# EAGLE design halloween-grave-bell-v02 (EAGLE 7.7.0)
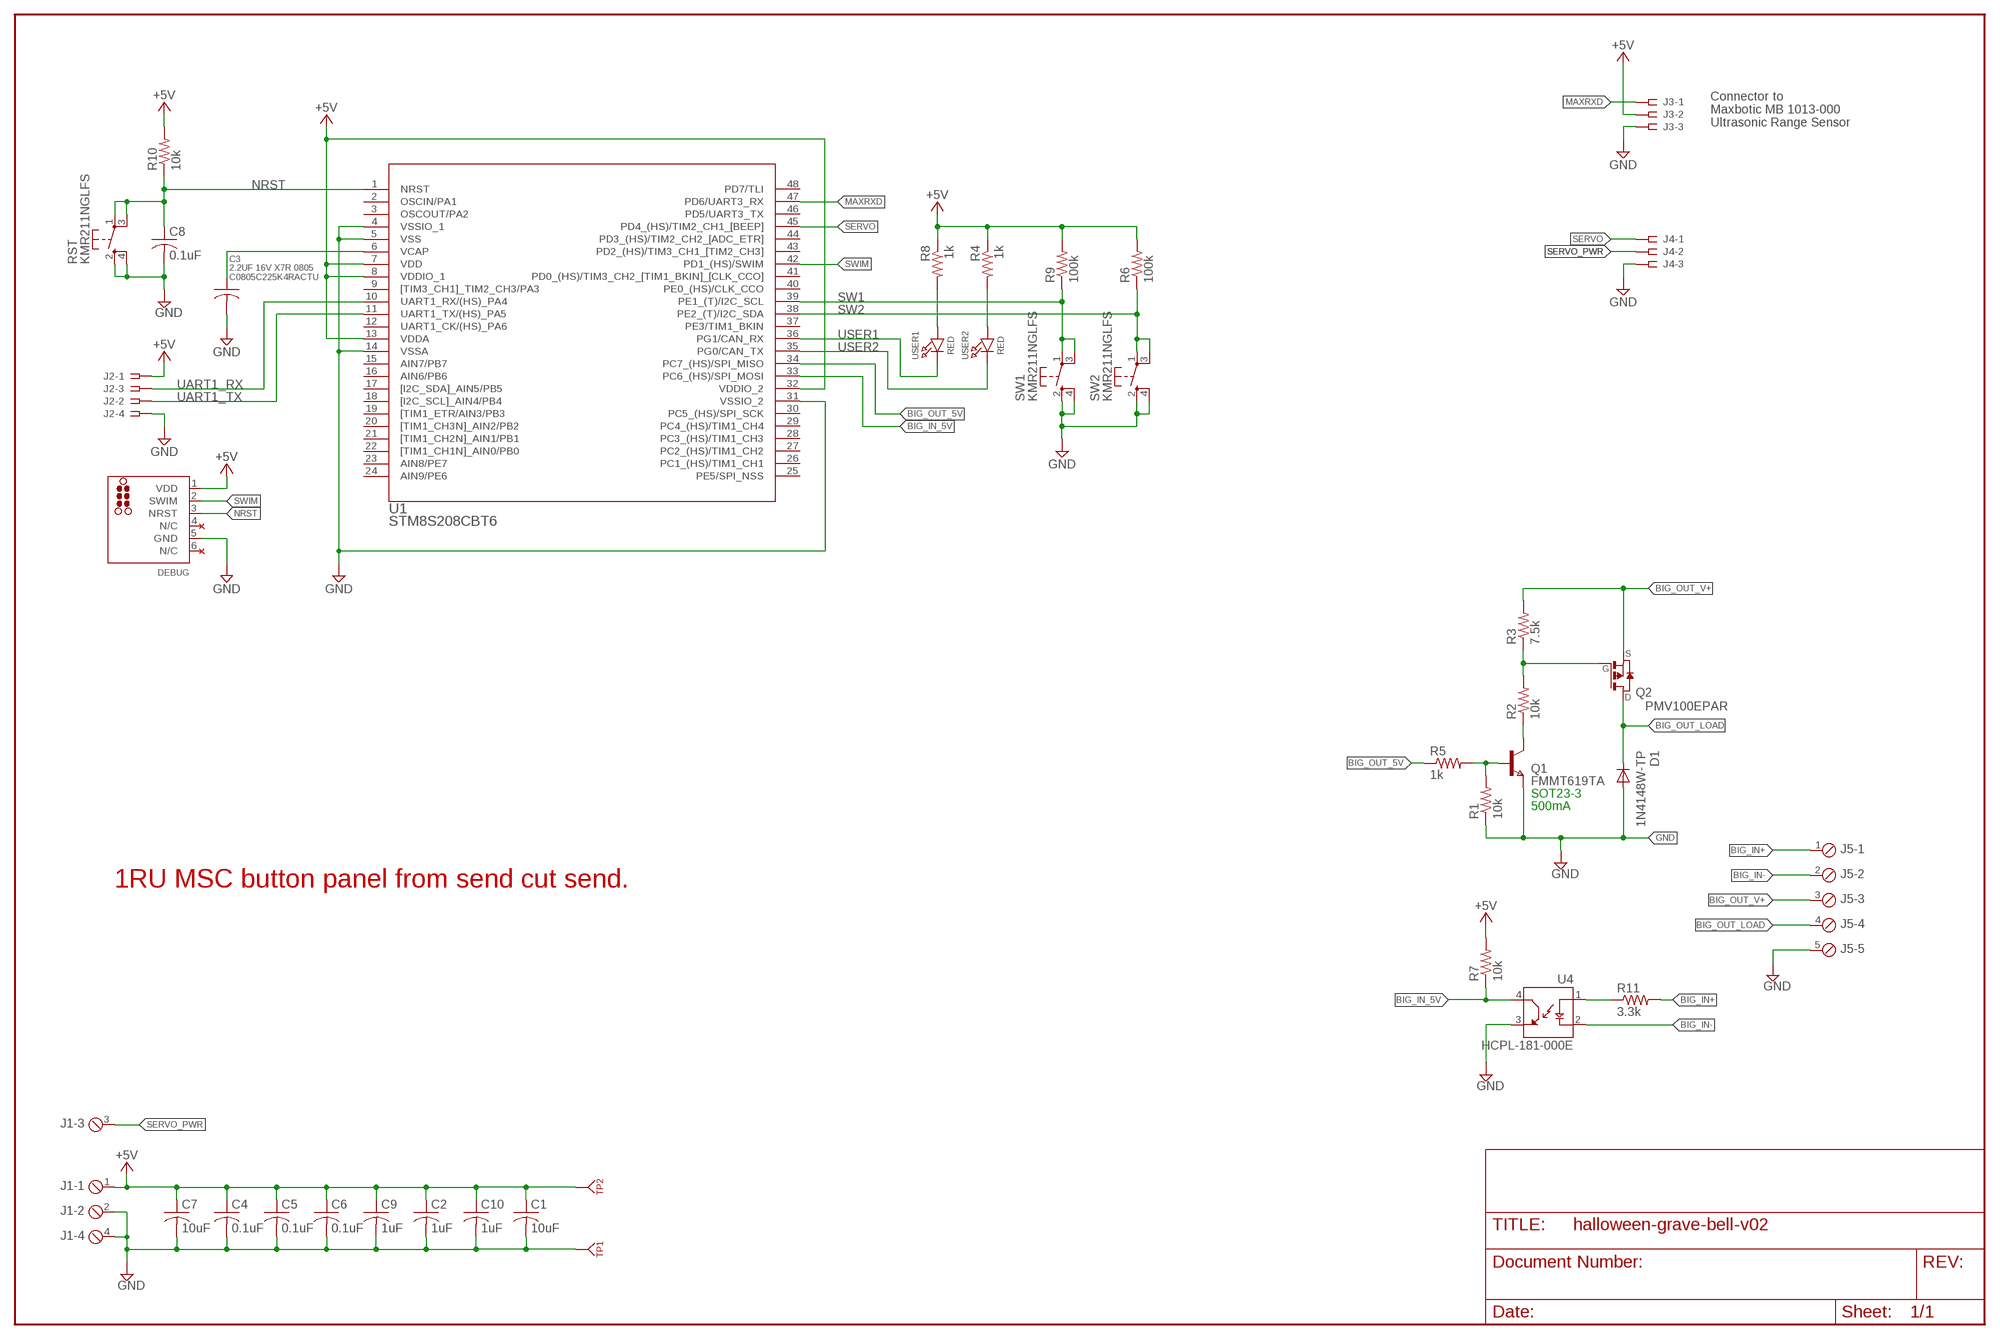
[diagram p0: schematic, sheet 1]

## Parts
C1  10uF  C-USC1210  [C1210]
C2  1uF  C-USC0603  [C0603]
C3  2.2UF 16V X7R 0805  C-USC0805  [C0805]
C4  0.1uF  C-USC0603  [C0603]
C5  0.1uF  C-USC0603  [C0603]
C6  0.1uF  C-USC0603  [C0603]
C7  10uF  C-USC1210  [C1210]
C8  0.1uF  C-USC0805  [C0805]
C9  1uF  C-USC0603  [C0603]
C10  1uF  C-USC0603  [C0603]
D1  1N4148W-TP  DIODE-SOD123  [SOD123]
DEBUG  TC2030-NL-STM8  [TC2030-NL]
J1  MPT4  [4POL254]
J2  SSW-104-02-S-S  [SSW-104-02-S-S]
J3  SSW-103-02-S-S  [SSW-103-02-S-S]
J4  SSW-103-02-S-S  [SSW-103-02-S-S]
J5  MPT5  [5POL254]
Q1  FMMT619TA  NPNSOT23  [SOT-23]
Q2  PMOSSOT23  [SOT-23]
R1  10k  R-US_R0603  [R0603]
R2  10k  R-US_R0603  [R0603]
R3  7.5k  R-US_R0603  [R0603]
R4  1k  R-US_R0805  [R0805]
R5  1k  R-US_R0603  [R0603]
R6  100k  R-US_R0805  [R0805]
R7  10k  R-US_R0603  [R0603]
R8  1k  R-US_R0805  [R0805]
R9  100k  R-US_R0805  [R0805]
R10  10k  R-US_R0805  [R0805]
R11  3.3k  R-US_R0603  [R0603]
RST  KMR211NGLFS  SPST_TACT-KMR2  [KMR2]
SW1  KMR211NGLFS  SPST_TACT-KMR2  [KMR2]
SW2  KMR211NGLFS  SPST_TACT-KMR2  [KMR2]
TP1  KEYSTONE_500X  [KEYSTONE_TP500X]
TP2  KEYSTONE_500X  [KEYSTONE_TP500X]
U1  STM8S208CBT6  [LQFP-48_STM]
U4  HCPL-181-000E  [SOIC254P675X240-4N]
USER1  RED  LED0805_NOOUTLINE  [CHIPLED_0805_NOOUTLINE]
USER2  RED  LED0805_NOOUTLINE  [CHIPLED_0805_NOOUTLINE]

## Nets
+5V: C1.1 C2.1 C4.1 C5.1 C6.1 C7.1 C9.1 C10.1 DEBUG.1(VDD) J1.1 J2.1 J3.2 R4.1 R6.2 R7.2 R8.1 R9.2 R10.2 TP2.1 U1.7(VDD) U1.8(VDDIO_1) U1.13(VDDA) U1.32(VDDIO_2)
BIG_IN+: J5.1 R11.2
BIG_IN-: J5.2 U4.2(CATHODE)
BIG_IN_5V: R7.1 U1.33(PC6_(HS)/SPI_MOSI) U4.4(COLLECTOR)
BIG_OUT_5V: R5.1 U1.34(PC7_(HS)/SPI_MISO)
BIG_OUT_LOAD: D1.C J5.4 Q2.1(D)
BIG_OUT_V+: J5.3 Q2.2(S) R3.2
GND: C1.2 C2.2 C3.2 C4.2 C5.2 C6.2 C7.2 C8.2 C9.2 C10.2 D1.A DEBUG.5(GND) J1.2 J1.4 J2.4 J3.3 J4.3 J5.5 Q1.2(E) R1.1 RST.2(S) RST.4(S1) SW1.2(S) SW1.4(S1) SW2.2(S) SW2.4(S1) TP1.1 U1.4(VSSIO_1) U1.5(VSS) U1.14(VSSA) U1.31(VSSIO_2) U4.3(EMITTER)
MAXRXD: J3.1 U1.47(PD6/UART3_RX)
N$1: Q1.1(C) R2.1
N$2: R8.2 USER1.A
N$4: Q2.3(G) R2.2 R3.1
N$5: R4.2 USER2.A
N$15: R11.1 U4.1(ANODE)
N$16: Q1.3(B) R1.2 R5.2
NRST: C8.1 DEBUG.3(NRST) R10.1 RST.1(P) RST.3(P1) U1.1(NRST)
SERVO: J4.1 U1.45(PD4_(HS)/TIM2_CH1_[BEEP])
SERVO_PWR: J1.3 J4.2
SW1: R9.1 SW1.1(P) SW1.3(P1) U1.39(PE1_(T)/I2C_SCL)
SW2: R6.1 SW2.1(P) SW2.3(P1) U1.38(PE2_(T)/I2C_SDA)
SWIM: DEBUG.2(SWIM) U1.42(PD1_(HS)/SWIM)
UART1_RX: J2.3 U1.10(UART1_RX/(HS)_PA4)
UART1_TX: J2.2 U1.11(UART1_TX/(HS)_PA5)
USER1: U1.36(PG1/CAN_RX) USER1.C
USER2: U1.35(PG0/CAN_TX) USER2.C
VCAP: C3.1 U1.6(VCAP)
Unconnected: DEBUG.4(N/C) DEBUG.6(N/C) U1.2(OSCIN/PA1) U1.3(OSCOUT/PA2) U1.9([TIM3_CH1]_TIM2_CH3/PA3) U1.12(UART1_CK/(HS)_PA6) U1.15(AIN7/PB7) U1.16(AIN6/PB6) U1.17([I2C_SDA]_AIN5/PB5) U1.18([I2C_SCL]_AIN4/PB4) U1.19([TIM1_ETR/AIN3/PB3) U1.20([TIM1_CH3N]_AIN2/PB2) U1.21([TIM1_CH2N]_AIN1/PB1) U1.22([TIM1_CH1N]_AIN0/PB0) U1.23(AIN8/PE7) U1.24(AIN9/PE6) U1.25(PE5/SPI_NSS) U1.26(PC1_(HS)/TIM1_CH1) U1.27(PC2_(HS)/TIM1_CH2) U1.28(PC3_(HS)/TIM1_CH3) U1.29(PC4_(HS)/TIM1_CH4) U1.30(PC5_(HS)/SPI_SCK) U1.37(PE3/TIM1_BKIN) U1.40(PE0_(HS)/CLK_CCO) U1.41(PD0_(HS)/TIM3_CH2_[TIM1_BKIN]_[CLK_CCO]) U1.43(PD2_(HS)/TIM3_CH1_[TIM2_CH3]) U1.44(PD3_(HS)/TIM2_CH2_[ADC_ETR]) U1.46(PD5/UART3_TX) U1.48(PD7/TLI)

## Notes on the sheet
- Connector to
  Maxbotic MB 1013-000
  Ultrasonic Range Sensor
- S
- G
- D
- ‎PMV100EPAR‎
- SOT23-3
- 500mA
- 1RU MSC button panel from send cut send.

## Library data of the parts
C1 C7 = rcl:C-US: CAPACITOR, American symbol; MFR: KEMET; MFR_PART_NO: C1210C105K4PACTU
C2 C4-C6 C8-C10 = rcl:C-US: CAPACITOR, American symbol
C3 = resistor:C-US: CAPACITOR, American symbol; MFR_PART_NUM: C0805C225K4RACTU
D1 = diode:DIODE-: DIODE
DEBUG = 0GLEN-TC2030-NL-STM8:TC2030-NL-STM8
J1 = con-phoenix-254:MPT4: PHOENIX CONNECTOR; OC_FARNELL: unknown; OC_NEWARK: unknown
J2 = con-samtec:SSW-104-02-S-S: THROUGH-HOLE .025" SQ POST SOCKET Source: Samtec SSW.pdf; MPN: SSW-104-02-S-S; OC_FARNELL: unknown; OC_NEWARK: 11P9384
J3 J4 = con-samtec:SSW-103-02-S-S: THROUGH-HOLE .025" SQ POST SOCKET Source: Samtec SSW.pdf; MPN: SSW-103-02-S-S; OC_FARNELL: unknown; OC_NEWARK: 11P9367
J5 = con-phoenix-254:MPT5: PHOENIX CONNECTOR; OC_FARNELL: unknown; OC_NEWARK: unknown
Q1 = zetex:NPNSOT23: NPN TRANSISTOR; MPN: DSS20201L-7; OC_FARNELL: 1710688; OC_NEWARK: 25R4555
Q2 = zetex:PMOSSOT23: MOS FET; OC_FARNELL: unknown; OC_NEWARK: unknown
R1-R11 = rcl:R-US_: RESISTOR, American symbol
RST SW1 SW2 = adafruit:SPST_TACT: SMT 6mm switch, EVQQ2 series http://www.ladyada.net/library/eagle
TP1 TP2 = 0GlenConnectors:KEYSTONE_500X
U1 = STM8S208CBT6-glen-lib:STM8S208CBT6; BUILT_BY: EMA_UL_Team; MANUFACTURER_PART_NUMBER: STM8S208CBT6; SOURCELIBRARY: StMicro_2011-06-07; VENDOR: STMicroelectronics
U4 = HCPL-181-000E:HCPL-181-000E: Optocoupler; SMD; Channels: 1; Out: transistor; Uinsul: 3.75kV; SO4; DESCRIPTION: Optocoupler; SMD; Channels: 1; Out: transistor; Uinsul: 3.75kV; SO4; DIGI-KEY_PART_NUMBER: 516-1646-1-ND; DIGI-KEY_PURCHASE_URL: https://www.digikey.com/product-detail/en/broadcom-limited/HCPL-181-000E/516-1646-1-ND/825340?utm_source=snapeda&utm_medium=aggregator&utm_campaign=symbol; MF: Broadcom Limited; MP: HCPL-181-000E; PACKAGE: SO-4 Broadcom
USER1 USER2 = microbuilder:LED: LED 0603 - 0603 Surface Mount Package 2mA: Green LED - Low Power (3.9mcd, 2ma, 1.7Vf) - Digikey: 475-2709-2-ND Orange LED - Low Power (9.8mcd, 2ma, 1.8Vf) - Digikey: 475-1194-2-ND Red LED - Low Power (5mcd, 2ma, 1.8Vf) - Digikey: 475-1195-2-ND Yellow LED - Low Power (7mcd, 2ma, 1.8Vf) - Digikey: 475-1196-2-ND 5mA: Blue LED - Low Power (17mcd, 5ma, 2.9Vf) - Digikey: LNJ937W8CRACT-ND 0805 - 0805 Surface Mount Package 2mA: Red LED (8.8mcd, 2mA, 1.8Vf, Clear) - Low Power [Digikey: 475-2510-1-ND] Green LED (5mcd, 2mA, 1.8Vf, Clear) - Low Power [Digikey: 475-2730-1-ND] Yellow LED (11.3mcd, 2mA, 1.8Vf, Clear) - Low Power [Digikey: 475-2555-1-ND] 20mA: Red LED (104mcd, 20mA, Diffused) - LS R976 [Digikey: 475-1278-6-ND] Red LED (12mcd, 20mA, 2.0Vf, Clear) - APT2012EC [Digikey: 754-1128-1-ND] Green LED (15mcd, 20mA, 2.2Vf, Clear) - APT2012GC [Digikey: 754-1131-1-ND] Orange LED (160mcd, 20mA, 2.1Vf, Clear) - APT2012SECK [Digikey: 754-1130-1-ND] 1206 - 1206 Surface Mount Package Green LED (26mcd, 20mA, Diffused) - LG N971 [Digikey: 475-1407-6-ND] Red LED (15mcd, 20mA, Diffused) - LH N974 [Digikey: 475-1416-6-ND] Cree - Cree High-Power Surface Mount LEDs XPEBWT-L1-0000-00D50 - White 111lm 350mA 2.9Vf 6200K 110° XTEAWT-00-0000-00000LEE3 - White 114lm 350mA 2.85Vf 5000K 115° Everlight - Everlight 45-21 Series Surface Mount LEDs 45-21/QK2C-B2832AC2CB2/2T - Warm White 2000mcd 20mA 3.25Vf 3050K 120° 45-21/LK2C-B38452C4CB2/2T - Nuetral White 2000mcd 20mA 3.25Vf 4150K 120° 45-21/LK2C-B50634C6CB2/2T - Cold White 2200mcd 20mA 3.25Vf 5650K 120° PLCC2 Reverse Mount LS T77K-J1L2-1-0-2-R18-Z - Red 11.25mcd 2mA 1.8Vf 630nm 120° LO T77K-L1M2-24-Z - Orange 19.6mcd 2mA 1.8Vf 606nm 120° LY T77K-K2M1-26-Z - Yellow 15.7mcd 2mA 1.8Vf 587nm 120°

## Board
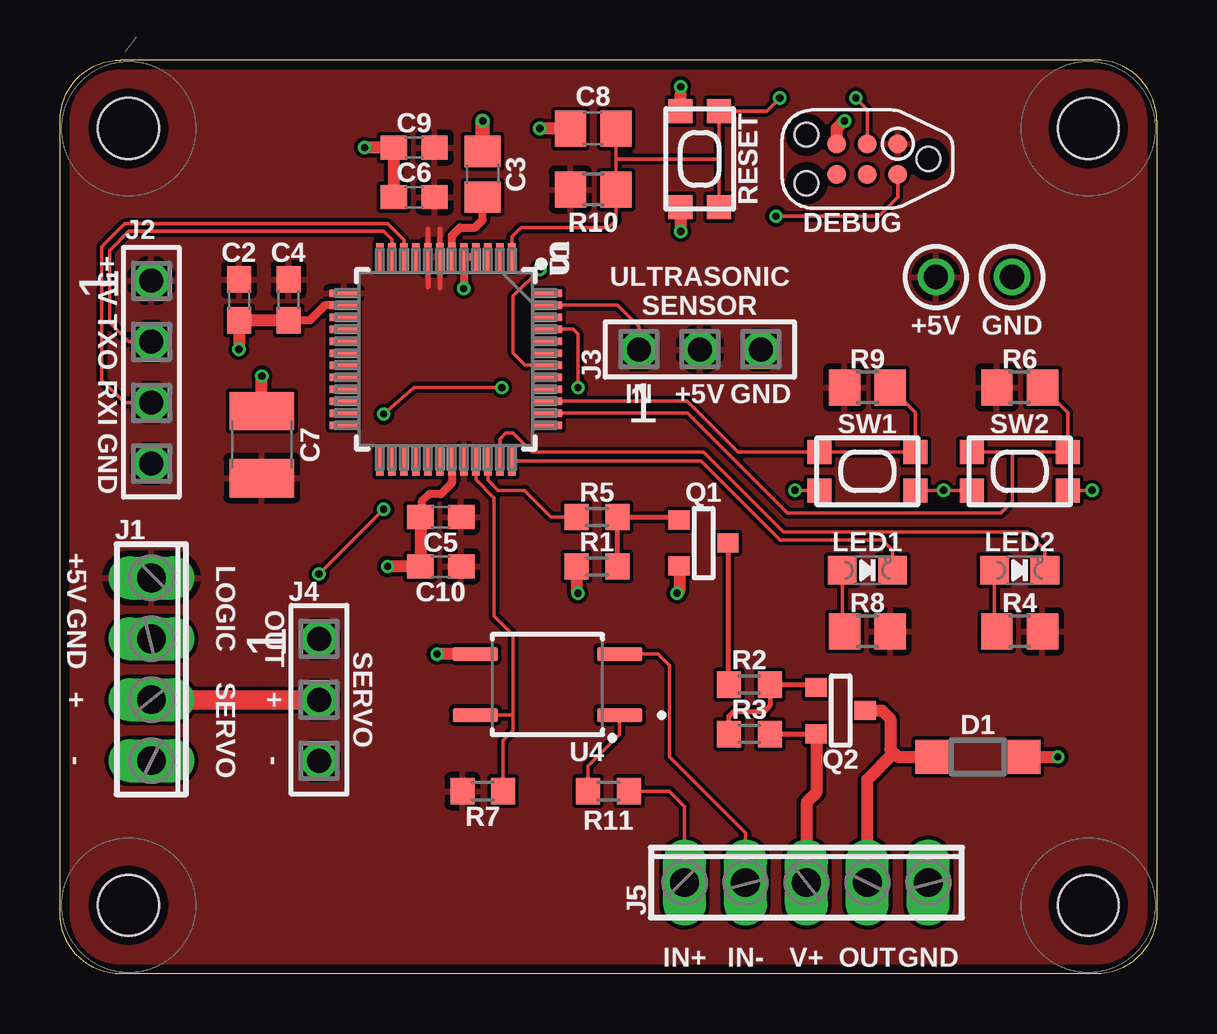
[diagram p1: board, top side]
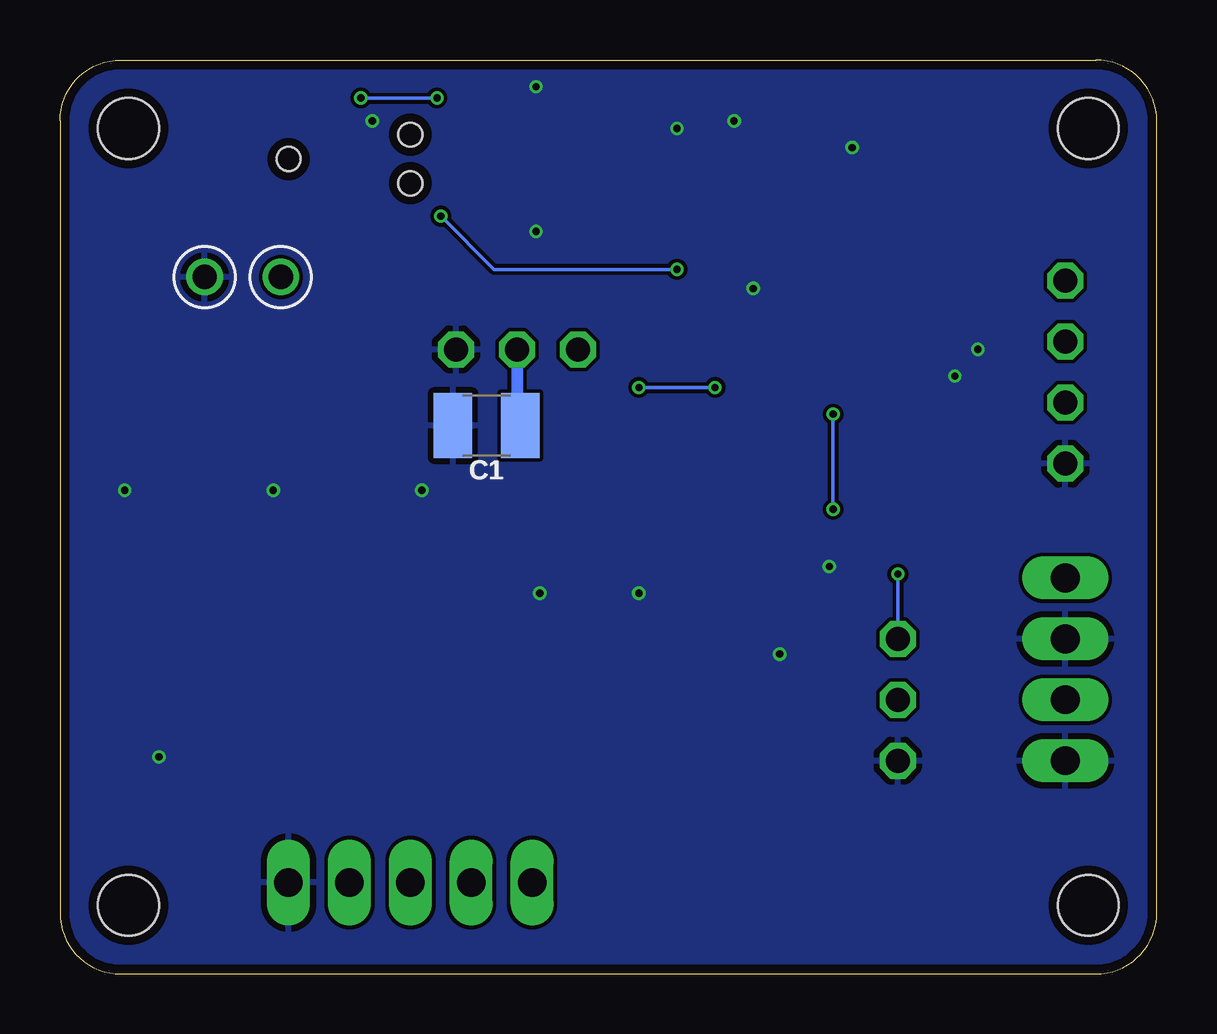
[diagram p2: board, bottom side, seen from below]

Size 45.72 x 38.1 mm. Coordinates in mm from the lower left corner, seen from the top.
Outline: 43.18,0 2.54,0 arc-90 0,2.54 0,35.56 arc-90 2.54,38.1 43.18,38.1 arc-90 45.72,35.56 45.72,2.54 arc-90 43.18,0
Copper layers (1*16): Top 0.035559375mm / dielectric 1.6mm / Bottom 0.035559375mm
Design rules "oshpark-2layer-2018": minimum track width 6mil, minimum drill 10mil, track to track 6mil, track to pad 6mil, pad to pad 6mil, via to via 6mil, smd to smd 6mil, copper to edge 15mil, drill to drill 6mil, minimum pad ring 5mil, minimum via ring 5mil, stop-mask expansion 2.5mil, vias tented up to drill 0mil, thermal gap 10mil
Holes 2.54 mm at 2.86,35.24 42.86,35.24 42.86,2.86 2.86,2.86

### Footprints (pad centres in the part's own frame; a part is rotated, then mirrored left to right if it is on the bottom)
C1210 = smd 1.6 x 2.7: 1 -1.4,0; 2 1.4,0
C0603 = smd 1.1 x 1: 1 -0.85,0; 2 0.85,0
C0805 = smd 1.3 x 1.5: 1 -0.95,0; 2 0.95,0
SOD123 = smd 1.4 x 1.4: A 1.9,0; C -1.9,0
TC2030-NL = smd 0.787 x 0.787: 1 -1.27,-0.635; 2 -1.27,0.635; 3 0,-0.635; 4 0,0.635; 5 1.27,-0.635; 6 1.27,0.635 | hole 0.991: -2.54,0; 2.54,-1.016; 2.54,1.016
4POL254 = drill 1.2 long: 1 -3.81,0; 2 -1.27,0; 3 1.27,0; 4 3.81,0
SSW-104-02-S-S = drill 1 pad 1.5 octagon: 1 -3.81,0; 2 -1.27,0; 3 1.27,0; 4 3.81,0
SSW-103-02-S-S = drill 1 pad 1.5 octagon: 1 -2.54,0; 2 0,0; 3 2.54,0
5POL254 = drill 1.2 long: 1 -5.08,0; 2 -2.54,0; 3 0,0; 4 2.54,0; 5 5.08,0
SOT-23 = smd 0.787 x 0.889: 1 0.025,-1.016; 2 -0.94,1.016; 3 0.991,1.016
R0603 = smd 1 x 1.1: 1 -0.85,0; 2 0.85,0
R0805 = smd 1.3 x 1.5: 1 -0.95,0; 2 0.95,0
KMR2 = smd 1 x 1: 1 2,0.8; 2 2,-0.8; 3 -2,0.8; 4 -2,-0.8
KEYSTONE_TP500X = drill 1.016: 1 0,0
LQFP-48_STM = smd 0.3 x 1.2: 1 -2.75,-4.25; 2 -2.25,-4.25; 3 -1.75,-4.25; 4 -1.25,-4.25; 5 -0.75,-4.25; 6 -0.25,-4.25; 7 0.25,-4.25; 8 0.75,-4.25; 9 1.25,-4.25; 10 1.75,-4.25; 11 2.25,-4.25; 12 2.75,-4.25; 25 2.75,4.25; 26 2.25,4.25; 27 1.75,4.25; 28 1.25,4.25; 29 0.75,4.25; 30 0.25,4.25; 31 -0.25,4.25; 32 -0.75,4.25; 33 -1.25,4.25; 34 -1.75,4.25; 35 -2.25,4.25; 36 -2.75,4.25 | smd 1.2 x 0.3: 13 4.25,-2.75; 14 4.25,-2.25; 15 4.25,-1.75; 16 4.25,-1.25; 17 4.25,-0.75; 18 4.25,-0.25; 19 4.25,0.25; 20 4.25,0.75; 21 4.25,1.25; 22 4.25,1.75; 23 4.25,2.25; 24 4.25,2.75; 37 -4.25,2.75; 38 -4.25,2.25; 39 -4.25,1.75; 40 -4.25,1.25; 41 -4.25,0.75; 42 -4.25,0.25; 43 -4.25,-0.25; 44 -4.25,-0.75; 45 -4.25,-1.25; 46 -4.25,-1.75; 47 -4.25,-2.25; 48 -4.25,-2.75
SOIC254P675X240-4N = smd 1.89 x 0.59: 1 -3.01,1.27; 2 -3.01,-1.27; 3 3.01,-1.27; 4 3.01,1.27
CHIPLED_0805_NOOUTLINE = smd 1.2 x 1.2: A 0,-1.05; C 0,1.05

### Placement (x,y rotation side)
C1  27.94,22.86 180 bottom
C2  7.46,28.1 270 top
C3  17.62,33.34 90 top
C4  9.53,28.1 270 top
C5  15.88,19.05 180 top
C6  14.76,32.38 180 top
C7  8.41,22.07 90 top
C8  22.23,35.24 180 top
C9  14.76,34.45 180 top
C10  15.88,16.99 180 top
D1  38.26,9.05 0 top
DEBUG  33.66,33.97 180 top
J1  3.81,12.7 270 top
J2  3.81,25.08 270 top
J3  26.67,26.04 0 top
J4  10.79,11.43 270 top
J5  31.11,3.81 0 top
Q1  26.83,17.94 90 top
Q2  32.54,10.95 90 top
R1  22.38,16.99 0 top
R2  28.73,12.06 0 top
R3  28.73,10 0 top
R4  40.01,14.29 180 top
R5  22.38,19.05 0 top
R6  40.01,24.45 180 top
R7  17.62,7.62 180 top
R8  33.66,14.29 180 top
R9  33.66,24.45 180 top
R10  22.23,32.7 180 top
R11  22.86,7.62 0 top
RST  26.67,33.97 270 top
SW1  33.66,20.95 0 top
SW2  40.01,20.95 0 top
TP1  39.69,29.05 0 bottom
TP2  36.51,29.05 0 bottom
U1  16.09,25.62 180 top
U4  20.32,12.06 180 top
USER1  33.66,16.83 270 top
USER2  40.01,16.83 270 top

### Tracks (layer width: path | path; a pad name or v marks a point on that pad's centre or on a via)
+5V
  Top 0.203: 15.34,31.05 U1.8 15.34,28.64 | U1.7 15.84,31.05 | 15.84,28.61 15.84,29.78
  Bottom 0.508: J3.2 26.67,22.99 C1.1
  pour Top (isolate 0.152): 45.72,0 0,0 0,38.1 45.72,38.1
BIG_IN+
  Top 0.152: J5.1 26.04,6.99 25.4,7.62 R11.2
BIG_IN-
  Top 0.152: U4.2 24.92,13.34 25.4,12.86 25.4,9.05 28.57,5.87 J5.2
BIG_IN_5V
  Top 0.152: U1.33 17.34,20.61 18.1,19.84 18.1,14.92 18.89,14.13 18.89,10.79 | 18.89,10.79 18.89,10.16 18.47,9.74 R7.1 | U4.4 18.89,10.79
BIG_OUT_5V
  Top 0.152: U1.34 17.84,20.58 18.26,20.16 19.37,20.16 20.48,19.05 R5.1
BIG_OUT_LOAD
  Top 0.508: Q2.1 34.27,10.98 34.61,10.64 34.61,9.37 34.77,9.21 | 34.77,9.21 34.92,9.05 D1.C | J5.4 33.66,8.1 34.77,9.21
BIG_OUT_V+
  Top 0.203: R3.2 31.52,10 Q2.2
  Top 0.508: Q2.2 31.53,7.56 31.11,7.14 J5.3
GND  (via drill 0.3)
  Top 0.152: SW1.4 v30.64,20.16 | SW1.2 36.2,20.16 | 36.2,20.16 SW2.4 | SW2.2 v43.02,20.16 | v36.83,20.16 36.2,20.16
  Top 0.203: 25.87,36.66 v25.88,36.99 | 25.87,31.12 v25.88,30.96
  Top 0.33: U1.14 11.05,27.88 10.42,27.25 C4.2 | U1.4 U1.5 16.84,28.58 | U1.31 16.34,20.46 15.88,20 15.4,20 15.08,19.68 15.08,19.11 C5.2
  Top 0.356: 16.84,28.58 v16.83,28.57
  Top 0.508: C8.2 v20,35.24 | RST.4 25.87,36.66 | RST.2 25.87,31.12 | 18,34.19 C3.2 | R1.1 21.53,15.93 v21.59,15.88 | Q1.2 25.81,15.97 v25.72,15.88 | D1.A v41.6,9.04 v41.59,9.05 | DEBUG.5 32.38,35.24 v32.7,35.56 | v12.7,34.45 C9.2 C6.2 | v7.46,26.04 C2.2 C4.2 | C5.2 C10.2 v13.65,16.99 | U4.3 v15.72,13.34 | C7.2 v8.41,24.92
  Top 0.61: C3.2 v17.62,35.56
  pour Bottom (isolate 0.152): 45.72,0 0,0 0,38.1 45.72,38.1
MAXRXD
  Top 0.152: J3.1 24.13,26.99 23.24,27.88 U1.47
N$1
  Top 0.203: Q1.1 27.84,12.1 R2.1
N$2
  Top 0.152: USER1.A 32.6,14.39 R8.2
N$4
  Top 0.203: R3.1 27.88,10.74 28.1,10.95 29.37,10.95 29.58,11.17 R2.2 31.41,12.06 Q2.3
N$5
  Top 0.152: USER2.A 38.95,14.39 R4.2
N$15
  Top 0.152: R11.1 22.01,8.68 23.33,9.99 U4.1
N$16
  Top 0.152: 25.69,19.05 Q1.3
  Top 0.203: 25.69,19.05 R5.2 R1.2
NRST  (via drill 0.3)
  Top 0.152: DEBUG.3 33.66,36.04 v33.18,36.51 | v30,36.51 29.46,35.97 RST.3 27.47,33.98 | 27.47,33.98 RST.1 | C8.1 23.18,33.97 | 23.18,33.97 R10.1 23.18,31.43 22.86,31.11 19.21,31.11 18.84,30.74 U1.1 | 27.47,33.98 27.46,33.97 23.18,33.97
  Bottom 0.152: v33.18,36.51 v30,36.51
SERVO  (via drill 0.3)
  Top 0.152: U1.45 21.39,26.88 21.59,26.67 v21.59,24.45 | v18.41,24.45 14.76,24.45 v13.49,23.34 | v10.79,16.67 v13.49,19.37
  Bottom 0.152: v21.59,24.45 v18.41,24.45 | v13.49,23.34 v13.49,19.37 | v10.79,16.67 J4.1
SERVO_PWR
  Top 0.813: J1.3 J4.2
SW1
  Top 0.152: R9.1 35.66,23.4 SW1.1 SW1.3 28.26,21.75 26.13,23.88 U1.39
SW2
  Top 0.152: SW2.3 39.69,21.75 | 39.69,21.75 SW2.1 42.01,23.4 R6.1 | U1.38 26.16,23.38 30.32,19.21 39.21,19.21 39.69,19.68 39.69,21.75
SWIM  (via drill 0.3)
  Top 0.152: U1.42 19.39,25.38 18.89,25.88 18.89,28.26 v20,29.37 | v29.84,31.59 34.13,31.59 34.92,32.38 DEBUG.2
  Bottom 0.152: v20,29.37 27.62,29.37 v29.84,31.59
UART1_RX
  Top 0.152: U1.10 14.34,30.59 13.65,31.27 2.7,31.27 1.75,30.32 1.75,24.77 2.7,23.81 J2.3
UART1_TX
  Top 0.152: J2.2 2.86,26.35 2.06,27.15 2.06,30.16 2.86,30.96 13.49,30.96 13.84,30.61 U1.11
USER1
  Top 0.152: USER1.C 34.7,17.68 34.29,18.1 30,18.1 26.73,21.38 U1.36
USER2
  Top 0.152: U1.35 18.34,22.3 18.57,22.54 18.89,22.54 19.68,21.75 26.83,21.75 30.16,18.41 40.32,18.41 41.05,17.68 USER2.C
VCAP
  Top 0.33: U1.6 16.34,30.78 16.67,31.11 17.3,31.11 17.62,31.43 C3.1

### Text on the board
tNames: RESET
tDocu: 2-56 hex nut keepout / 3/16" short diag = 0.217" long diag / keep out = 0.110" radius
_tsilk: C8 | C9 | RESET | C6 | C3 | R10 | DEBUG | J2 | C2 | C4 | +5V | U1 | ULTRASONIC / SENSOR | +5V | GND | TXO | J3 | IN | +5V | GND | R9 | R6 | RXI | SW1 | SW2 | C7 | GND | R5 | Q1 | J1 | C5 | R1 | LED1 | LED2 | +5V | J4 | C10 | LOGIC | R8 | R4 | GND | OUT | R2 | + | + | SERVO | R3 | SERVO | U4 | D1 | - | - | Q2 | R7 | R11 | J5 | IN+ | IN- | V+ | OUT | GND
_bsilk: C1